# EAGLE design Simon-85_Rev_B (EAGLE 4.16)
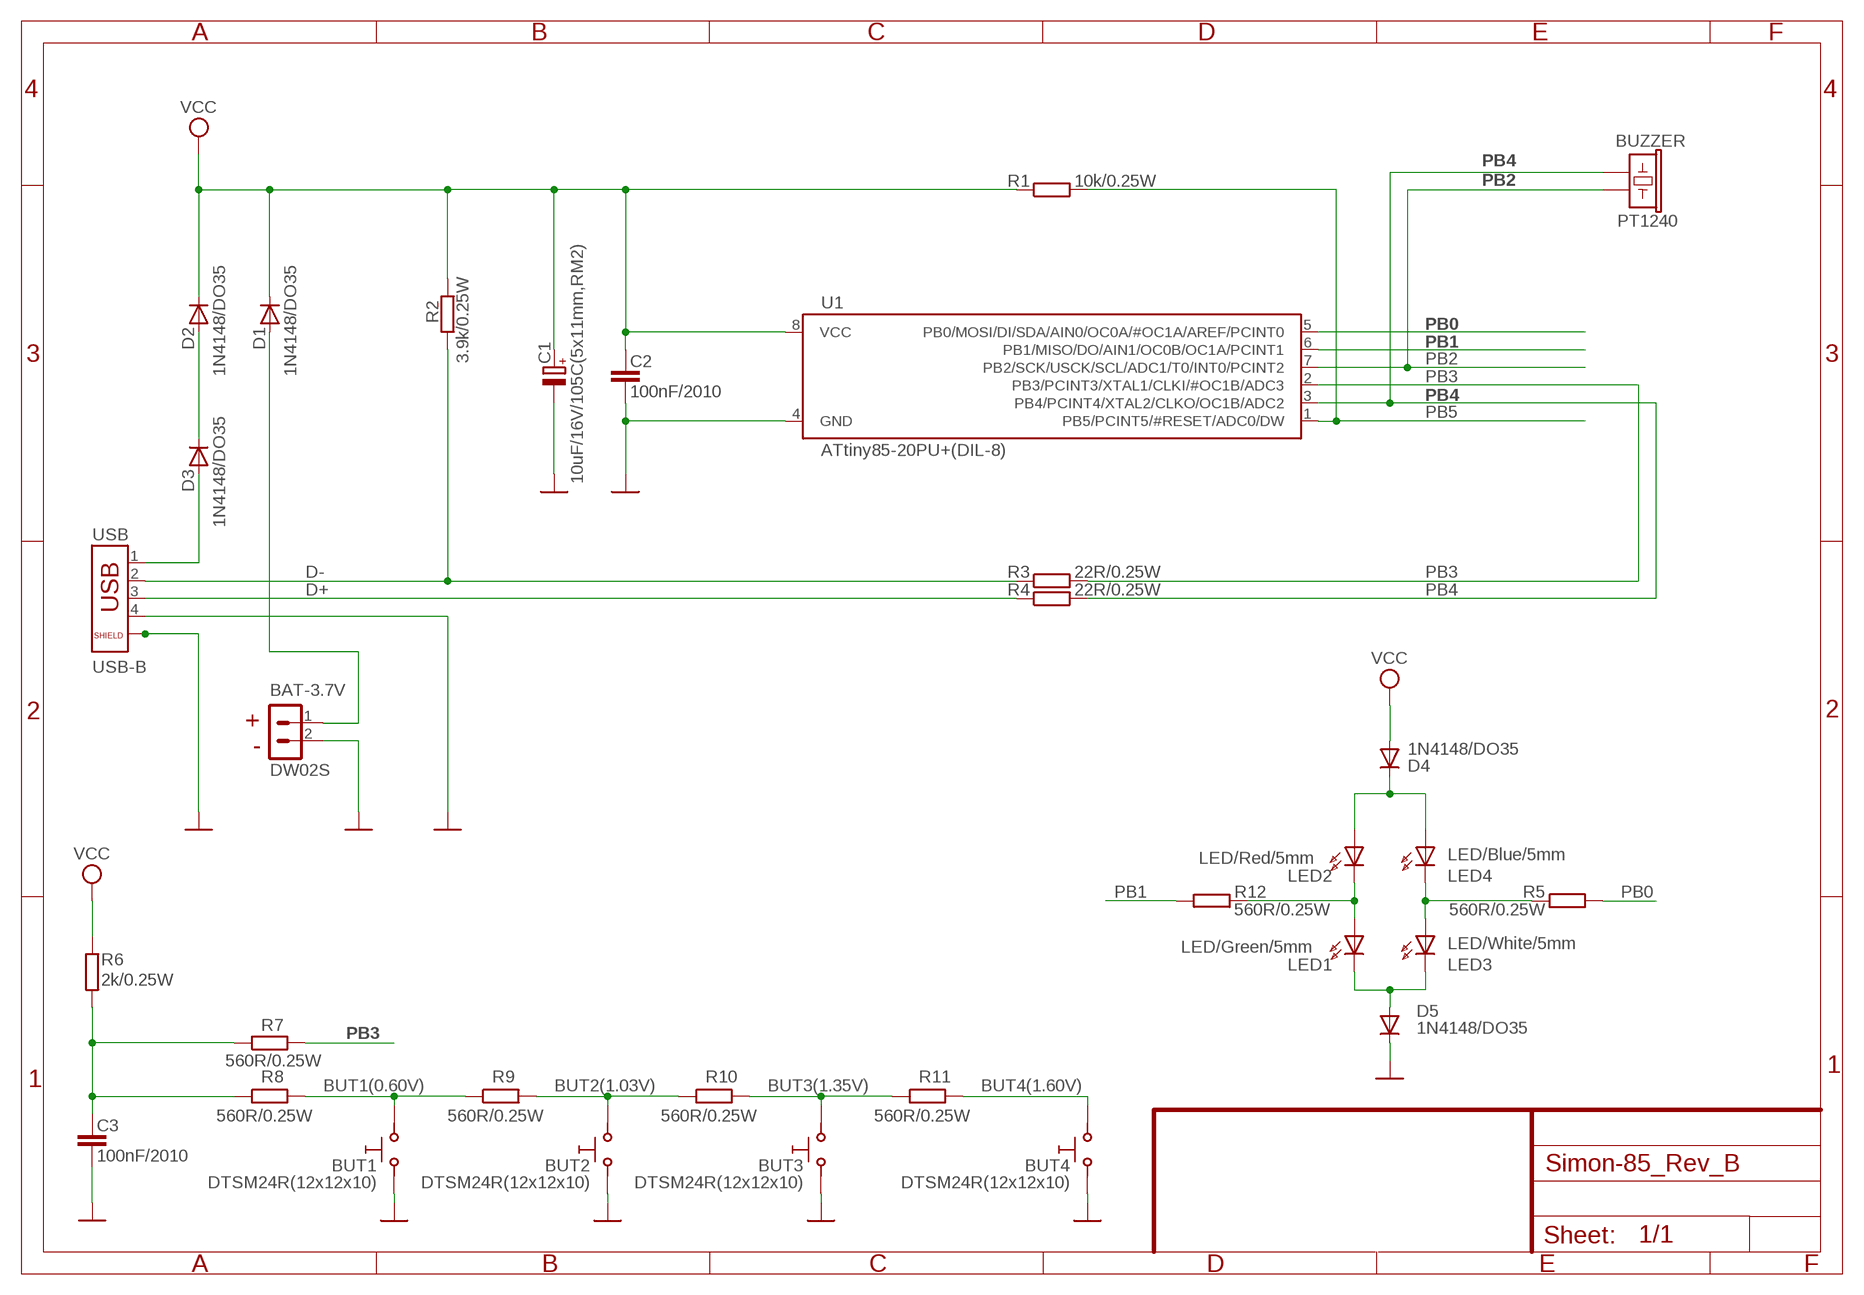
[diagram p0: schematic, sheet 1]

## Parts
BAT-3.7V  DW02S  CON2DW02S  [DW02S]
BUT1  DTSM24R(12x12x10)  SW-TAKTSS  [SW_TAKT12X12SS]
BUT2  DTSM24R(12x12x10)  SW-TAKTSS  [SW_TAKT12X12SS]
BUT3  DTSM24R(12x12x10)  SW-TAKTSS  [SW_TAKT12X12SS]
BUT4  DTSM24R(12x12x10)  SW-TAKTSS  [SW_TAKT12X12SS]
BUZZER  PT1240  BUZ3  [BUZ14MM]
C1  10uF/16V/105C(5x11mm,RM2)  CPOL-EUE2-5_BOT  [E2-5_B]
C2  100nF/2010  C-EU025-025X050  [C025-025X050]
C3  100nF/2010  C-EU025-025X050  [C025-025X050]
D1  1N4148/DO35  DDO35  [DO35-200MILS]
D2  1N4148/DO35  DDO35  [DO35-200MILS]
D3  1N4148/DO35  DDO35  [DO35-200MILS]
D4  1N4148/DO35  DDO35  [DO35-200MILS]
D5  1N4148/DO35  DDO35  [DO35-200MILS]
LED1  LED/Green/5mm  LED5.0MM  [LED-5.0MM]
LED2  LED/Red/5mm  LED5.0MM  [LED-5.0MM]
LED3  LED/White/5mm  LED5.0MM  [LED-5.0MM]
LED4  LED/Blue/5mm  LED5.0MM  [LED-5.0MM]
R1  10k/0.25W  R-EU_0207/10  [0207/10]
R2  3.9k/0.25W  R-EU_0207/10  [0207/10]
R3  22R/0.25W  R-EU_0207/10  [0207/10]
R4  22R/0.25W  R-EU_0207/10  [0207/10]
R5  560R/0.25W  R-EU_0207/10  [0207/10]
R6  2k/0.25W  R-EU_0207/10  [0207/10]
R7  560R/0.25W  R-EU_0207/10  [0207/10]
R8  560R/0.25W  R-EU_0207/10  [0207/10]
R9  560R/0.25W  R-EU_0207/10  [0207/10]
R10  560R/0.25W  R-EU_0207/10  [0207/10]
R11  560R/0.25W  R-EU_0207/10  [0207/10]
R12  560R/0.25W  R-EU_0207/10  [0207/10]
U1  ATtiny85-20PU+(DIL-8)  ATTINY85-20PU  [DIP8]
USB  USB-B  USB_SHIELD  [USB_NEAR_BLACK]

## Nets
BUT1(0.60V): BUT1.P$2 R8.2 R9.1
BUT2(1.03V): BUT2.P$2 R9.2 R10.1
BUT3(1.35V): BUT3.P$2 R10.2 R11.1
BUT4(1.60V): BUT4.P$2 R11.2
BUT_SENSE: C3.1 R6.2 R7.1 R8.1
D+: R4.1 USB.3
D-: R2.1 R3.1 USB.2
GND [PWR]: BAT-3.7V.2 BUT1.P$1 BUT2.P$1 BUT3.P$1 BUT4.P$1 C1.- C2.2 C3.2 D5.K U1.4(GND) USB.4 USB.P$1 USB.P$2
N$1: D4.K LED2.A LED4.A
N$2 [PWR]: D2.A D3.K
N$3: LED3.A LED4.K(C) R5.1
N$4: D5.A LED1.K(C) LED3.K(C)
N$5: LED1.A LED2.K(C) R12.1
N$7 [PWR]: BAT-3.7V.1 D1.A
PB0: R5.2 U1.5(PB0/MOSI/DI/SDA/AIN0/OC0A/#OC1A/AREF/PCINT0)
PB1: R12.2 U1.6(PB1/MISO/DO/AIN1/OC0B/OC1A/PCINT1)
PB2: BUZZER.+ U1.7(PB2/SCK/USCK/SCL/ADC1/T0/INT0/PCINT2)
PB3: R3.2 R7.2 U1.2(PB3/PCINT3/XTAL1/CLKI/#OC1B/ADC3)
PB4: BUZZER.- R4.2 U1.3(PB4/PCINT4/XTAL2/CLKO/OC1B/ADC2)
PB5: R1.2 U1.1(PB5/PCINT5/#RESET/ADC0/DW)
VBUS [PWR]: D3.A USB.1
VCC [PWR]: C1.+ C2.1 D1.K D2.K D4.A R1.1 R2.2 R6.1 U1.8(VCC)

## Notes on the sheet
- +
- -

## Library data of the parts
BAT-3.7V = Penko:CON2
BUT1-BUT4 = gogo:SW-TAKT
BUZZER = gogo:BUZ
C1 = rcl:CPOL-EU: POLARIZED CAPACITOR, European symbol
C2 C3 = rcl:C-EU: CAPACITOR, European symbol
D1-D5 = DOUBLE-SIDE:D: DIODES
LED1-LED4 = DOUBLE-SIDE:LED
R1-R12 = rcl:R-EU_: RESISTOR, European symbol
U1 = OLIMEX_IC:ATTINY85: Atmel 8-bit AVR Microcontroller with 2/4/8K Bytes In-System Programmable Flash Features *High Performance, Low Power AVR® 8-Bit Microcontroller * Advanced RISC Architecture - 120 Powerful Instructions ? Most Single Clock Cycle Execution - 32 x 8 General Purpose Working Registers - Fully Static Operation * Non-volatile Program and Data Memories - 2/4/8K Bytes of In-System Programmable Program Memory Flash * Endurance: 10,000 Write/Erase Cycles - 128/256/512 Bytes In-System Programmable EEPROM * Endurance: 100,000 Write/Erase Cycles - 128/256/512 Bytes Internal SRAM -Programming Lock for Self-Programming Flash Program and EEPROM Data Security *Peripheral Features - 8-bit Timer/Counter with Prescaler and Two PWM Channels - 8-bit High Speed Timer/Counter with Separate Prescaler *2 High Frequency PWM Outputs with Separate Output Compare Registers * Programmable Dead Time Generator -USI - Universal Serial Interface with Start Condition Detector - 10-bit ADC * 4 Single Ended Channels * 2 Differential ADC Channel Pairs with Programmable Gain (1x, 20x) * Temperature Measurement - Programmable Watchdog Timer with Separate On-chip Oscillator - On-chip Analog Comparator * Special Microcontroller Features - debugWIRE On-chip Debug System - In-System Programmable via SPI Port -External and Internal Interrupt Sources - Low Power Idle, ADC Noise Reduction, and Power-down Modes - Enhanced Power-on Reset Circuit - Programmable Brown-out Detection Circuit - Internal Calibrated Oscillator * I/O and Packages - Six Programmable I/O Lines - 8-pin PDIP, 8-pin SOIC, 20-pad QFN/MLF, and 8-pin TSSOP (only ATtiny45/V) * Operating Voltage - 1.8 - 5.5V for ATtiny25V/45V/85V - 2.7 - 5.5V for ATtiny25/45/85 * Speed Grade - ATtiny25V/45V/85V: 0 - 4 MHz @ 1.8 - 5.5V, 0 - 10 MHz @ 2.7 - 5.5V - ATtiny25/45/85: 0 - 10 MHz @ 2.7 - 5.5V, 0 - 20 MHz @ 4.5 - 5.5V * Industrial Temperature Range * Low Power Consumption - Active Mode: * 1 MHz, 1.8V: 300 uA - Power-down Mode: * 0.1 uA at 1.8V
USB = OLIMEX_CONNECTORS:USB_SHIELD

## Board
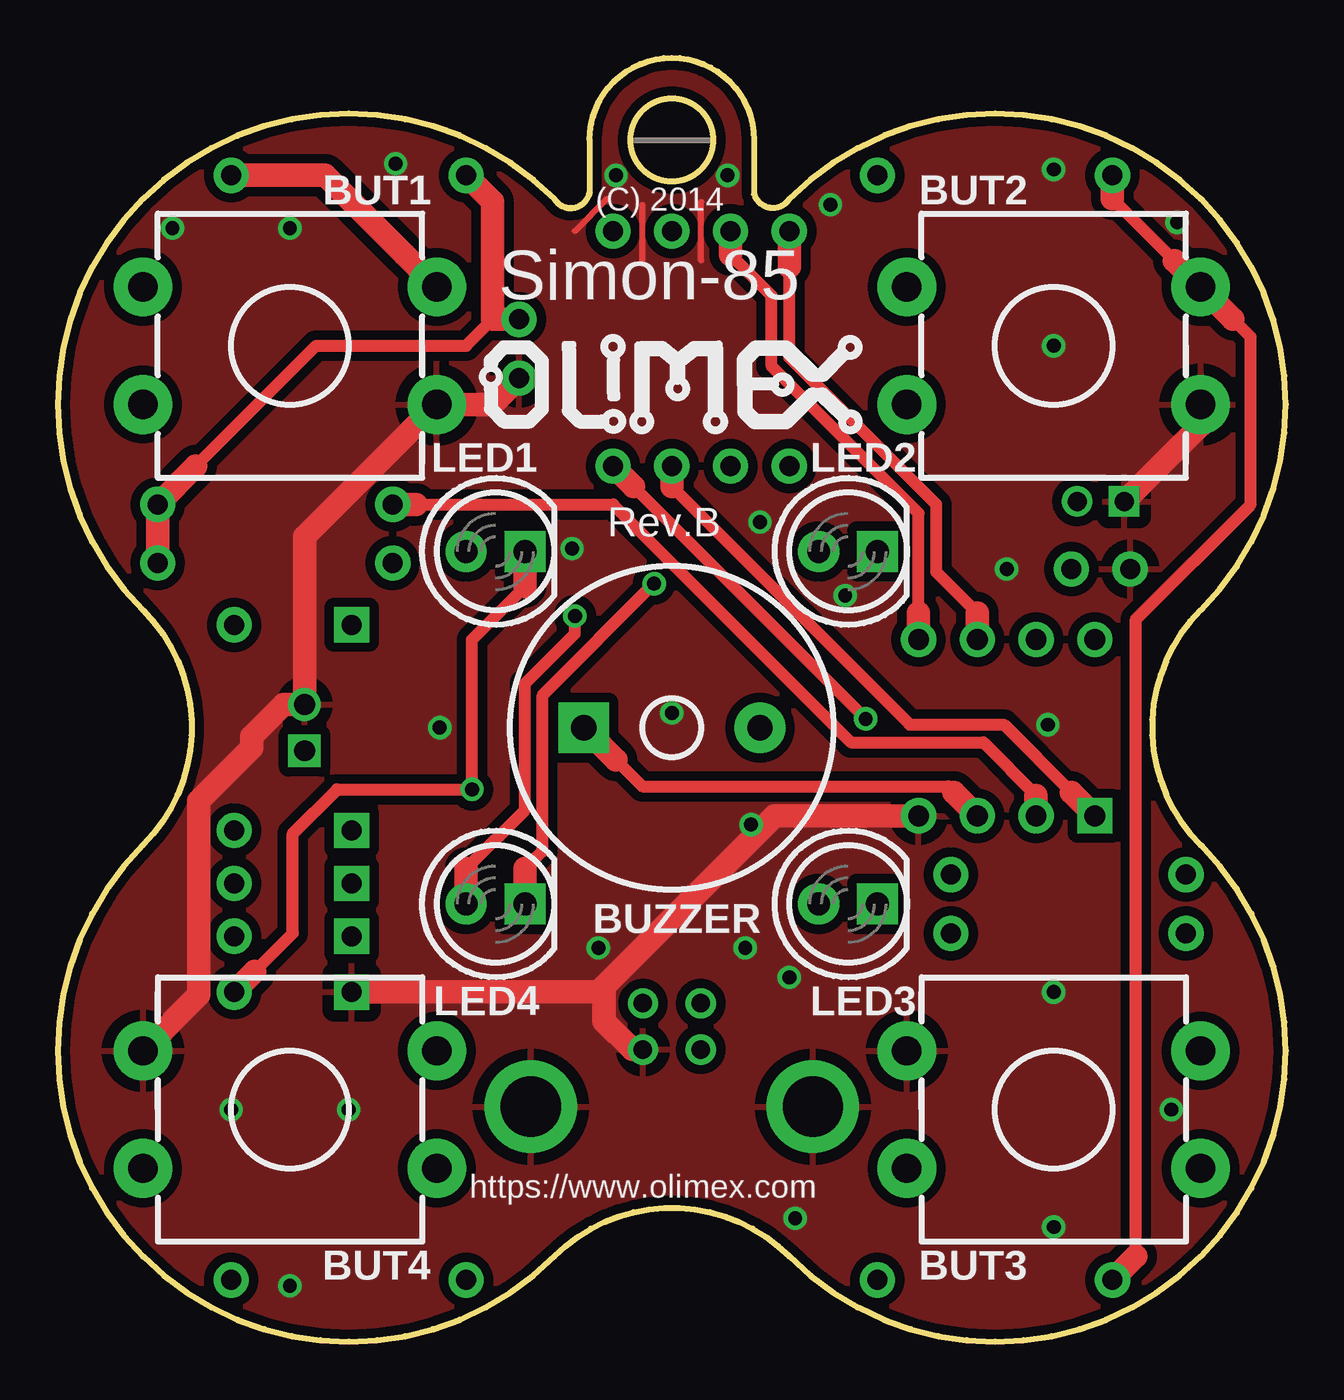
[diagram p1: board, top side]
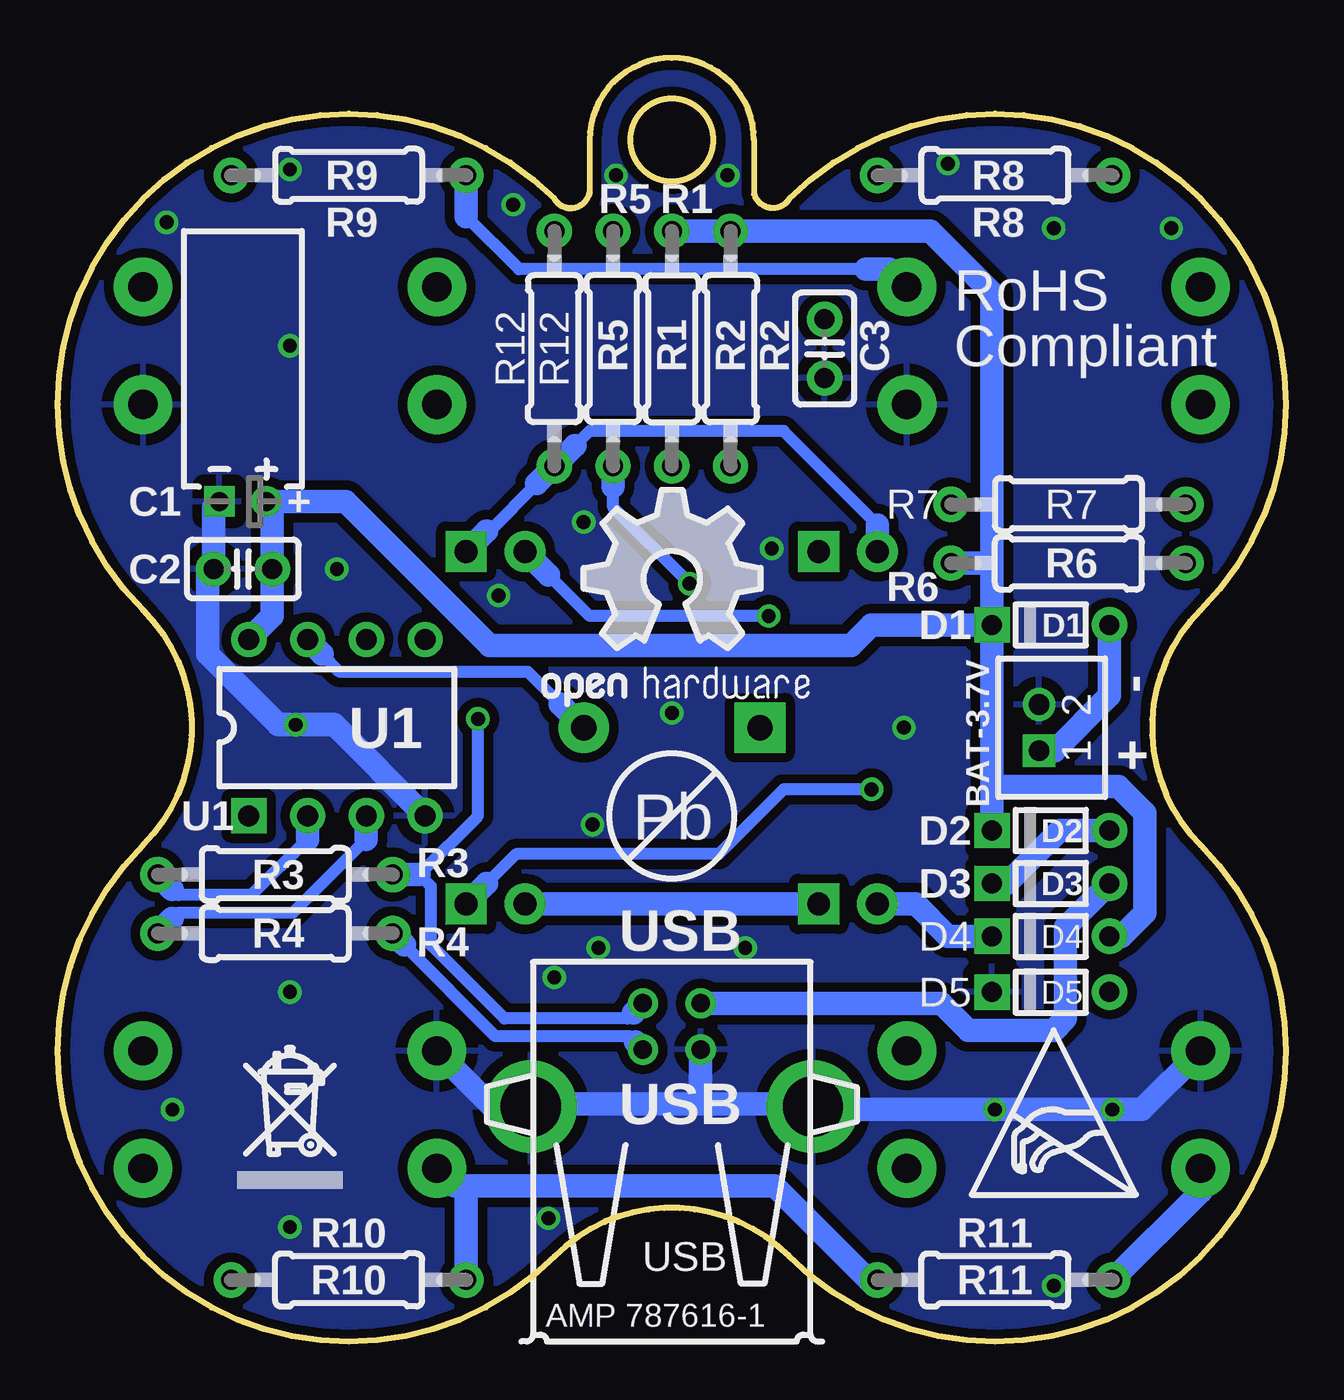
[diagram p2: board, bottom side, seen from below]

Size 53.08 x 55.5 mm. Coordinates in mm from the lower left corner, seen from the top.
Outline: 21.46,49.4 arc180 3.68,31.62 arc-90 3.68,21.46 arc180 21.46,3.68 arc-90 31.62,3.68 arc180 49.4,21.46 arc-90 49.4,31.62 arc180 31.62,49.4 arc-136 30.1,49.66 30.1,51.94 arc180 22.99,51.94 22.99,49.66 arc-136 21.46,49.4
Outline: circle at 26.54,51.94 radius 1.78
Copper layers (1*16): Top 0.035mm / dielectric 1.5mm / Bottom 0.035mm
Design rules "default": minimum track width 10mil, minimum drill 0.6mm, track to track 10mil, track to pad 10mil, pad to pad 10mil, via to via 10mil, smd to smd 1mil, copper to edge 10mil, drill to drill 8mil, minimum pad ring 10mil, minimum via ring 8mil, stop-mask expansion 2mil, vias tented up to drill 40mil, thermal gap 20mil
Holes 3.6 mm at 26.54,51.94

### Footprints (pad centres in the part's own frame; a part is rotated, then mirrored left to right if it is on the bottom)
DW02S = drill 0.9 square: 1 -1,0 | drill 0.9 round: 2 1,0
SW_TAKT12X12SS = drill 1.27 pad 2.54 round: P$1 -2.54,-6.35; P$2 2.54,-6.35; P$3 2.54,6.35; P$4 -2.54,6.35
BUZ14MM = drill 1.092 pad 2.184 round: + 3.81,0 | drill 1.092 pad 2.184 square: - -3.81,0
E2-5_B = drill 0.813 pad 1.27 round: + -1.016,0 | drill 0.813 pad 1.27 square: - 1.016,0
C025-025X050 = drill 0.864 pad 1.524 round: 1 -1.27,0; 2 1.27,0
DO35-200MILS = drill 0.864 pad 1.524 round: A 2.54,0 | drill 0.864 pad 1.524 square: K -2.54,0
LED-5.0MM = drill 0.991 pad 1.778 round: A -1.27,0 | drill 0.991 pad 1.778 square: K 1.27,0
0207/10 = drill 0.864 pad 1.524 round: 1 -5.08,0; 2 5.08,0
DIP8 = drill 0.9 pad 1.524 square: 1 -3.81,-3.81 | drill 0.9 pad 1.524 round: 2 -1.27,-3.81; 3 1.27,-3.81; 4 3.81,-3.81; 5 3.81,3.81; 6 1.27,3.81; 7 -1.27,3.81; 8 -3.81,3.81
USB_NEAR_BLACK = drill 0.8 round: 1 1.25,6.5; 2 -1.25,6.5; 3 -1.25,4.5; 4 1.25,4.5 | drill 2.6 pad 4 round: P$1 -6.096,2.032; P$2 6.096,2.032

### Placement (x,y rotation side)
BAT-3.7V  10.67,26.54 90 bottom
BUT1  10.03,43.05 90 top
BUT2  43.05,43.05 90 top
BUT3  43.05,10.03 270 top
BUT4  10.03,10.03 270 top
BUZZER  26.54,26.54 0 top
C1  45.08,36.32 180 bottom
C2  45.08,33.4 180 bottom
C3  19.94,42.93 270 bottom
D1  10.16,30.99 0 bottom
D2  10.16,22.1 0 bottom
D3  10.16,19.81 0 bottom
D4  10.16,17.53 0 bottom
D5  10.16,15.11 0 bottom
LED1  18.92,34.16 0 top
LED2  34.16,34.16 0 top
LED3  34.16,18.92 0 top
LED4  18.92,18.92 0 top
R1  26.54,42.93 270 bottom
R2  24,42.93 90 bottom
R3  43.69,20.19 180 bottom
R4  43.69,17.65 180 bottom
R5  29.08,42.93 90 bottom
R6  9.4,33.65 0 bottom
R7  9.4,36.19 180 bottom
R8  12.57,50.42 0 bottom
R9  40.51,50.42 180 bottom
R10  40.51,2.67 0 bottom
R11  12.57,2.67 0 bottom
R12  31.62,42.93 90 bottom
U1  41.02,26.54 0 bottom
U$1  [RECYCLE_BIN1/8]  45.34,6.6 0 bottom
U$3  [ESD_SYMBOL]  13.59,6.35 0 bottom
U$4  [LOGO-OPENHARDWARE_8X8]  26.54,32.89 0 bottom
U$5  [OLIMEX1_V]  35.94,39.12 0 top
U$6  [PB]  26.54,22.73 0 bottom
USB  26.54,8.13 0 bottom

### Tracks (layer width: path | path; a pad name or v marks a point on that pad's centre or on a via)
BUT1(0.60V)
  Top 1.016: BUT1.P$2 14.99,46.99 11.56,50.42 8.76,50.42 R8.2
  Bottom 0.508: 35.43,48.64 33.15,46.35 18.16,46.35
  Bottom 1.016: 35.43,48.64 R9.1 | BUT1.P$2 17.14,46.35 18.16,46.35
BUT2(1.03V)
  Top 0.508: 48.26,46.74 45.59,49.4 | 46.61,3.68 46.61,31.24 51.56,36.19 51.56,43.43 50.8,44.2
  Top 1.016: 48.26,46.74 BUT2.P$2 50.8,44.2 | 45.59,49.4 R9.2 | R10.1 46.61,3.68
BUT3(1.35V)
  Bottom 1.016: R11.1 18.03,2.67 22.1,6.73 35.43,6.73 | 35.43,6.73 R10.2 | 35.43,6.73 35.94,6.73 BUT3.P$2
BUT4(1.60V)
  Bottom 1.016: R11.2 3.68,6.48 BUT4.P$2
BUT_SENSE
  Top 0.508: 5.97,37.85 11.18,43.05 17.65,43.05 18.8,44.2
  Top 1.016: C3.1 18.8,44.2 18.8,49.28 R8.1 | R6.2 R7.1 5.97,37.85
D+
  Bottom 0.508: 28.12,12.95 28.37,13.21 34.16,13.21 38.1,17.14
  Bottom 1.016: USB.3 28.12,12.95 | 38.1,17.14 R4.1
D-  (via drill 0.6)
  Top 0.508: v34.92,26.92 24.89,36.96
  Top 1.016: 24.89,36.96 R2.1
  Bottom 0.508: 28.2,14.22 28.45,13.97 33.78,13.97 36.96,17.14 36.96,19.68 37.46,20.19 34.92,22.73 v34.92,26.92
  Bottom 1.016: USB.2 28.2,14.22 | 37.46,20.19 R3.1
GND  (via drill 0.6)
  Top 0.254: 25.27,46.61 25.27,49.15 | 27.81,46.74 27.81,49.28 | 22.35,48.01 23.75,49.4
  Top 1.016: C3.2 18.8,40.51 BUT1.P$1 10.67,34.8 BAT-3.7V.2 9.76,27.54 8.38,26.16 8.38,25.65 6.1,23.37 6.1,14.99 BUT4.P$1 | USB.4 24.84,12.63 23.62,13.84 23.62,15.11 | U1.4 30.99,22.73 23.62,15.37 23.62,15.11 | C1.- 49.4,39.62 BUT2.P$1 | 23.62,15.11 D5.K
  Bottom 1.016: 25.29,10.29 20.57,10.29 USB.P$2 20.32,10.03 6.22,10.03 BUT4.P$1 | 25.29,10.29 USB.4 | 25.29,10.29 32.51,10.29 USB.P$1 34.29,10.16 BUT3.P$1 | C1.- 46.35,36.07 C2.2 46.61,33.15 46.61,29.72 43.56,26.67 v42.8,26.67 41.15,26.67 U1.4
  other vias: 16.51,26.54 23.37,17.02 29.72,17.02 48.13,10.03 31.88,5.33 41.02,33.4 24.13,50.42 28.96,50.42 48.39,48.39 31.62,15.75 4.95,48.13 14.6,50.93 29.97,22.35 30.35,35.43 34.04,32.26 22.22,34.29 26.54,27.18 33.4,49.15 43.05,15.11 43.05,4.95 12.57,10.03 10.03,2.41 7.49,10.03 43.05,50.67 43.05,43.05 10.03,48.13
  pour Top (isolate 0.406, rank 3): -2.67,-2.67 55.75,-2.67 55.75,58.29 -2.67,58.29
  pour Bottom (isolate 0.406, rank 3): -5.21,-5.21 58.29,-5.21 58.29,60.83 -5.21,60.83
N$1  (via drill 0.6)
  Top 0.508: 17.65,20.45 20.19,22.99 20.19,28.45 22.35,30.61 v22.35,31.37
  Top 1.016: LED4.A 17.65,20.45
  Bottom 0.508: 31.88,33.15 30.1,31.37 v22.35,31.37
  Bottom 1.016: LED4.A 16,18.92 14.6,17.53 D4.K | 31.88,33.15 LED2.A
N$2
  Bottom 1.016: D3.K 12.06,19.81 9.78,22.1 D2.A
N$3  (via drill 0.6)
  Top 0.508: 20.19,20.45 20.95,21.21 20.95,27.94 v25.78,32.77
  Top 1.016: LED4.K 20.19,20.45
  Bottom 0.508: 29.08,36.96 29.08,36.07 v25.78,32.77
  Bottom 1.016: LED4.K 21.72,18.92 31.62,18.92 LED3.A | 29.08,36.96 R5.1
N$4  (via drill 0.6)
  Top 0.508: 20.19,32.64 17.91,30.35 v17.91,23.88 12.06,23.88 10.16,21.97 10.16,17.65 8.51,16
  Top 1.016: 20.19,32.64 LED1.K | D5.A 8.51,16
  Bottom 0.508: 34.54,19.81 33.27,21.08 24.51,21.08 21.72,23.88 v17.91,23.88
  Bottom 1.016: 34.54,19.81 LED3.K
N$5
  Bottom 0.508: 32.38,37.08 34.42,35.05 34.54,35.05 | 17.65,35.31 21.72,39.37 30.1,39.37 30.73,38.73
  Bottom 1.016: LED1.A 17.65,35.31 | 34.54,35.05 LED2.K | 32.38,37.08 R12.1 30.73,38.73
N$7
  Bottom 1.016: BAT-3.7V.1 10.02,25.54 7.62,27.94 D1.A
PB0
  Top 0.508: 29.08,46.99 30.86,45.21 30.86,42.16 37.21,35.81 37.21,31.5
  Top 1.016: U1.5 37.21,31.5 | 29.08,46.99 R5.2
PB1
  Top 0.508: 39.75,31.5 37.97,33.27 37.97,36.19 31.62,42.54 31.62,46.48
  Top 1.016: U1.6 39.75,31.5 | 31.62,46.48 R12.2
PB2
  Bottom 0.508: 41.66,29.72 40.89,28.96 32.77,28.96 31.37,27.56
  Bottom 1.016: 41.66,29.72 U1.7 | BUZZER.+ 31.37,27.56
PB3
  Top 0.508: 42.29,23.62 40,25.91 34.29,25.91 24,36.19 15.49,36.19
  Top 1.016: 42.29,23.62 U1.2 | R7.2 15.49,36.19
  Bottom 0.508: 42.29,21.72 44.7,19.3 47.88,19.3 48.13,19.56
  Bottom 1.016: 48.13,19.56 R3.2 | U1.2 42.29,21.72
PB4
  Top 0.508: 38.73,23.75 38.48,24 25.27,24 24.13,25.15
  Top 1.016: 38.73,23.75 U1.3 | 24.13,25.15 BUZZER.-
  Bottom 0.508: 39.75,21.72 42.93,18.54 47.88,18.54 48.13,18.29
  Bottom 1.016: 48.13,18.29 R4.2 | U1.3 39.75,21.72
PB5
  Top 0.508: 26.54,36.96 36.83,26.67 40.89,26.67 43.81,23.75
  Top 1.016: R1.2 26.54,36.96 | 43.81,23.75 U1.1
VBUS
  Bottom 1.016: D3.A 9.52,17.91 9.52,13.97 10.03,13.46 13.72,13.46 14.88,14.63 USB.1
VCC
  Bottom 1.016: 12.7,24 D2.K | 12.7,24 D1.K | U1.8 43.81,31.37 C2.1 43.81,36.32 | D1.K 12.7,33.65 | 43.81,36.32 C1.+ | 43.81,36.32 40.64,36.32 34.42,30.1 18.8,30.1 17.91,30.99 D1.K | 12.7,33.65 R6.1 | 12.7,33.65 12.7,45.34 15.37,48.01 R2.2 R1.1 | 12.7,24 7.24,24 6.1,22.86 6.1,18.54 7.11,17.53 D4.A

### Text on the board
bPlace: + | - | +
tNames: (C) 2014 | Simon-85 | Rev.B | https://www.olimex.com
bNames: RoHS | Compliant